# EAGLE design BMS-Shield rev2 (EAGLE 8.1.0)
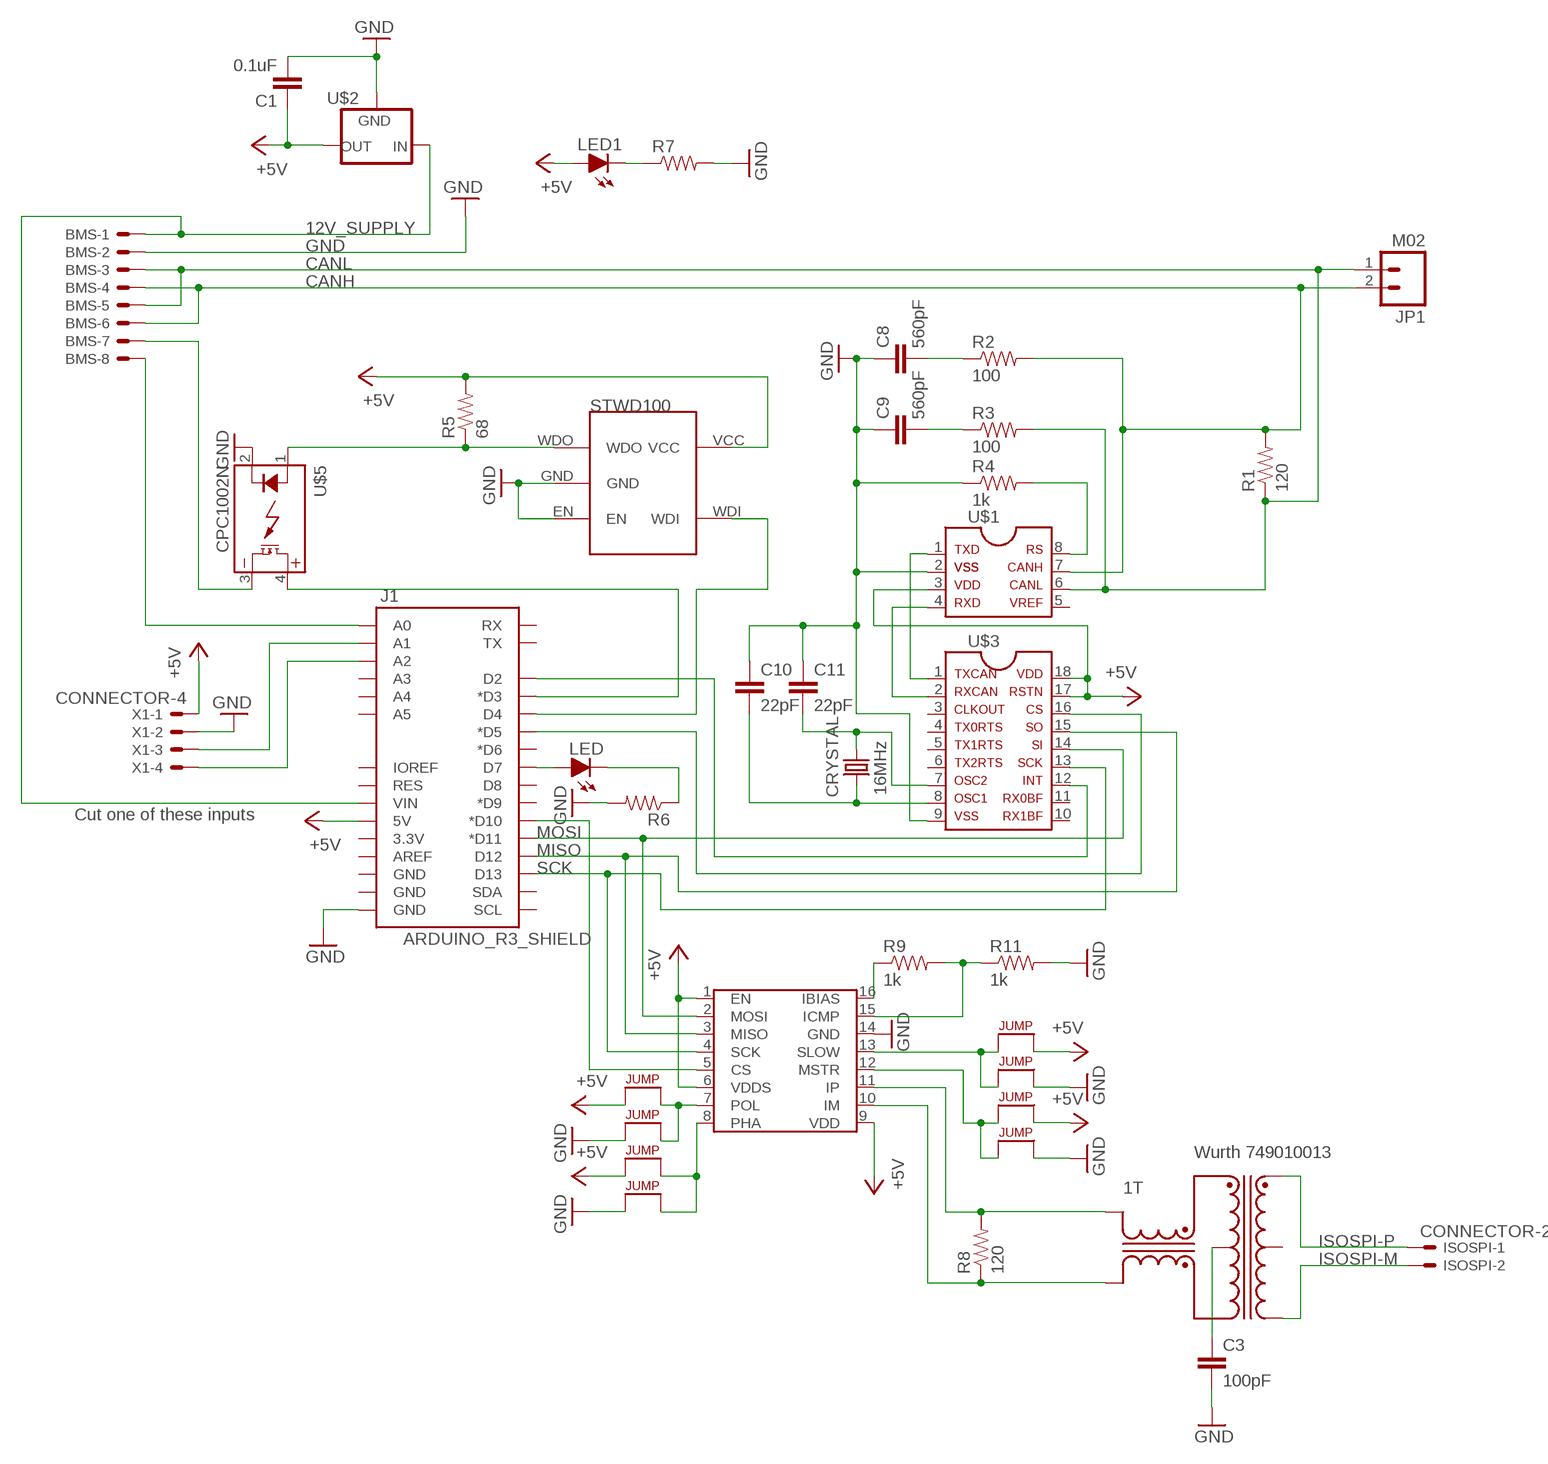
[diagram p0: schematic, sheet 1]

## Parts
1  TRANSFORMER_749010013  [749010013]
BMS  MINIFIT_5566-8  [MINIFIT_5566-8]
C1  0.1uF  CAP0805  [0805]
C3  100pF  CAP0805  [0805]
C8  560pF  CAP0805  [0805]
C9  560pF  CAP0805  [0805]
C10  22pF  CAP0805  [0805]
C11  22pF  CAP0805  [0805]
CRYSTAL  16MHz  CRYSTALSMD  [HC49UP]
ISOSPI  CONNECTOR-2  [MINIFIT_5566-2]
J1  ARDUINO_R3_SHIELD  [UNO_R3_SHIELD]
JP1  M02  [1X02]
LED  LED-0805  [LED-805]
LED1  LED-0805  [LED-805]
R1  120  RESISTOR0805-RES  [0805]
R2  100  RESISTOR0805-RES  [0805]
R3  100  RESISTOR0805-RES  [0805]
R4  1k  RESISTOR0805-RES  [0805]
R5  68  RESISTOR0805-RES  [0805]
R6  RESISTOR0805-RES  [0805]
R7  RESISTOR0805-RES  [0805]
R8  120  RESISTOR0805-RES  [0805]
R9  1k  RESISTOR0805-RES  [0805]
R11  1k  RESISTOR0805-RES  [0805]
U$1  MCP2551  [SOIC-08]
U$2  5VREG_LM340-NLM340MPX-5.0/NOPB  [SOT223]
U$3  MCP2515SMD  [SOIC-18W]
U$4  STWD100  [SOT23-5]
U$5  CPC1002N  [SOP04]
U$6  LTC6820  [MSOP-16]
U$7  JUMPER  [0805]
U$8  JUMPER  [0805]
U$9  JUMPER  [0805]
U$10  JUMPER  [0805]
U$11  JUMPER  [0805]
U$12  JUMPER  [0805]
U$13  JUMPER  [0805]
U$14  JUMPER  [0805]
X1  CONNECTOR-4  [MINIFIT_5566-4]

## Nets
12V_SUPPLY: BMS.1 J1.VIN U$2.1(IN)
+5V: C1.1 J1.5V LED1.A R5.2 U$1.3 U$2.3(OUT) U$3.17 U$3.18 U$4.VCC U$6.1(EN) U$6.6(VDDS) U$6.9(VDD) U$7.1 U$10.1 U$11.2 U$13.2 X1.1
CANH: BMS.4 BMS.6 JP1.2 R1.2 R2.2 U$1.7
CANL: BMS.3 BMS.5 JP1.1 R1.1 R3.2 U$1.6
CS: J1.D5(*D5) U$3.16
GND: BMS.2 C1.2 C3.2 C8.1 C9.1 C10.1 C11.1 J1.GND@0(GND) R4.1 R6.2 R7.2 R11.2 U$1.2 U$2.2(GND) U$2.4(GND) U$3.9 U$4.EN U$4.GND U$5.2(CONTROL-) U$6.14(GND) U$8.1 U$9.1 U$12.2 U$14.2 X1.2
ISOSPI-M: 1.3(T:D-) ISOSPI.2
ISOSPI-P: 1.1(T:D+) ISOSPI.1
MISO: J1.D12 U$3.15 U$6.3(MISO)
MOSI: J1.D11(*D11) U$3.14 U$6.2(MOSI)
N$1: BMS.8 J1.A0
N$5: R5.1 U$4.WDO U$5.1(CONTROL+)
N$6: J1.D4 U$4.WDI
N$7: J1.D7 LED.A
N$8: BMS.7 U$5.3(DC-)
N$9: J1.D3(*D3) U$5.4(DC+)
N$10: J1.D2 U$3.12
N$11: C10.2 CRYSTAL.2 U$3.8
N$12: U$1.1 U$3.1
N$13: U$1.4 U$3.2
N$14: C8.2 R2.1
N$15: C11.2 CRYSTAL.1 U$3.7
N$16: R4.2 U$1.8
N$17: C9.2 R3.1
N$18: LED.C R6.1
N$19: J1.A1 X1.3
N$20: J1.A2 X1.4
N$21: J1.D10(*D10) U$6.5(CS)
N$22: LED1.C R7.1
N$23: U$6.7(POL) U$7.2 U$8.2
N$24: U$6.8(PHA) U$9.2 U$10.2
N$25: R9.1 U$6.16(IBIAS)
N$26: R9.2 R11.1 U$6.15(ICMP)
N$27: U$6.13(SLOW) U$11.1 U$12.1
N$28: U$6.12(MSTR) U$13.1 U$14.1
N$29: 1.14(T:X-) R8.1 U$6.10(IM)
N$30: 1.16(T:X+) R8.2 U$6.11(IP)
N$31: 1.15(T:CX) C3.1
SCK: J1.D13 U$3.13 U$6.4(SCK)
Unconnected: 1.2(T:CD) 1.6(R:D+) 1.7(R:CD) 1.8(R:D-) 1.9(R:X-) 1.10(R:CX) 1.11(R:X+) J1.3.3V J1.A3 J1.A4 J1.A5 J1.AREF J1.D6(*D6) J1.D8 J1.D9(*D9) J1.GND@1(GND) J1.GND@2(GND) J1.IOREF J1.RES J1.RX J1.SCL J1.SDA J1.TX U$1.5 U$3.3 U$3.4 U$3.5 U$3.6 U$3.10 U$3.11

## Notes on the sheet
- Cut one of these inputs ➡️
- Wurth 749010013

## Library data of the parts
1 = HyTechDevices:TRANSFORMER_749010013: Wurth Electronics Midcom 749010013 10/100BaseTX Ethernet Transformer Datasheet <http://www.mouser.com/ds/2/445/749010013-311000.pdf> Mouser Page <http://www.mouser.com/ProductDetail/Wurth-Electronics-Midcom/749010013/?qs=40TFAHZMFvcjCZphxWYgVw%3D%3D>
BMS = HyTechDevices:MINIFIT_5566-8: Mini-Fit Junior connector 8 pole Source: http://www.molex.com; OC_FARNELL: unknown; OC_NEWARK: unknown
C1 C3 C8-C11 = HyTechDevices:CAP: Capacitor Standard 0603 ceramic capacitor, and 0.1" leaded capacitor.
CRYSTAL = SparkFun-FreqCtrl:CRYSTAL: Various standard crystals. Proven footprints.
ISOSPI = HyTechDevices:CONNECTOR-2: Mini-Fit Junior connector 2 pole Source: http://www.molex.com; OC_FARNELL: 1822072; OC_NEWARK: unknown
J1 = HyTechDevices:ARDUINO_R3_SHIELD: Shield form compatible with the Arduino Uno R3. Source: Sparkfun <https://github.com/sparkfun/SparkFun-Eagle-Libraries>
JP1 = HyTechDevices:M02: Standard 2-pin 0.1" header. NOTES ON THE VARIANTS LOCK and LOCK_LONGPADS... This footprint was designed to help hold the alignment of a through-hole component (i.e. 6-pin header) while soldering it into place. You may notice that each hole has been shifted either up or down by 0.005 of an inch from it's more standard position (which is a perfectly straight line). This slight alteration caused the pins (the squares in the middle) to touch the edges of the holes. Because they are alternating, it causes a "brace" to hold the component in place. 0.005 has proven to be the perfect amount of "off-center" position when using our standard breakaway headers. Although looks a little odd when you look at the bare footprint, once you have a header in there, the alteration is very hard to notice. Also,if you push a header all the way into place, it is covered up entirely on the bottom side. This idea of altering the position of holes to aid alignment will be further integrated into the Sparkfun Library for other footprints. It can help hold any component with 3 or more connection pins. Note: The Sparkfun version includes many other packages including surface mount that may be of future interest. Source: Sparkfun <https://github.com/sparkfun/SparkFun-Eagle-Libraries>
LED LED1 = HyTechDevices:LED: Light Emitting Diode (LED) Source: Dangerous Prototypes Eagle Library <https://github.com/DangerousPrototypes/Eagle_Part_Library>
R1-R9 R11 = HyTechDevices:RESISTOR: Resistor Basic schematic elements and footprints for 0603, 1206, and PTH resistors.
U$1 = HyTechDevices:MCP2551: MCP2551 High-Speed CAN Transceiver Product Webpage <https://www.microchip.com/wwwproducts/en/MCP2551> Datasheet <http://ww1.microchip.com/downloads/en/DeviceDoc/21667f.pdf> This device is outdated It is replaced by MCP2561. Comparison Page <https://www.microchip.com/wwwproducts/ProductCompare/MCP2551/MCP2561> Product Webpage <https://www.microchip.com/wwwproducts/en/MCP2561> Datasheet <http://ww1.microchip.com/downloads/en/DeviceDoc/20005167C.pdf>
U$2 = HyTechDevices:5VREG_LM340-N: Voltage Regulator 5v linear voltage regulator Datasheet <http://www.mouser.com/ProductDetail/Texas-Instruments/LM340MPX-50-NOPB/?qs=X1J7HmVL2ZGZwtTFRQ9ItA%3D%3D> MAX current out: 1.5A MAX voltage in: 35V
U$3 = HyTechDevices:MCP2515: MCP2515 CAN Controller with SPI Interface Datasheet <http://ww1.microchip.com/downloads/en/DeviceDoc/21801G.pdf>
U$4 = HyTechDevices:STWD100: STWD100 Watchdog timer
U$5 = HyTechDevices:CPC1002N: IXYS Solid State Relay .7A
U$6 = HyTechDevices:LTC6820
U$7-U$14 = HyTechDevices:JUMPER: Jumper for changing operation of a device
X1 = HyTechDevices:CONNECTOR-4: Mini-Fit Junior connector 4 pole Source: http://www.molex.com; OC_FARNELL: unknown; OC_NEWARK: unknown

## Board
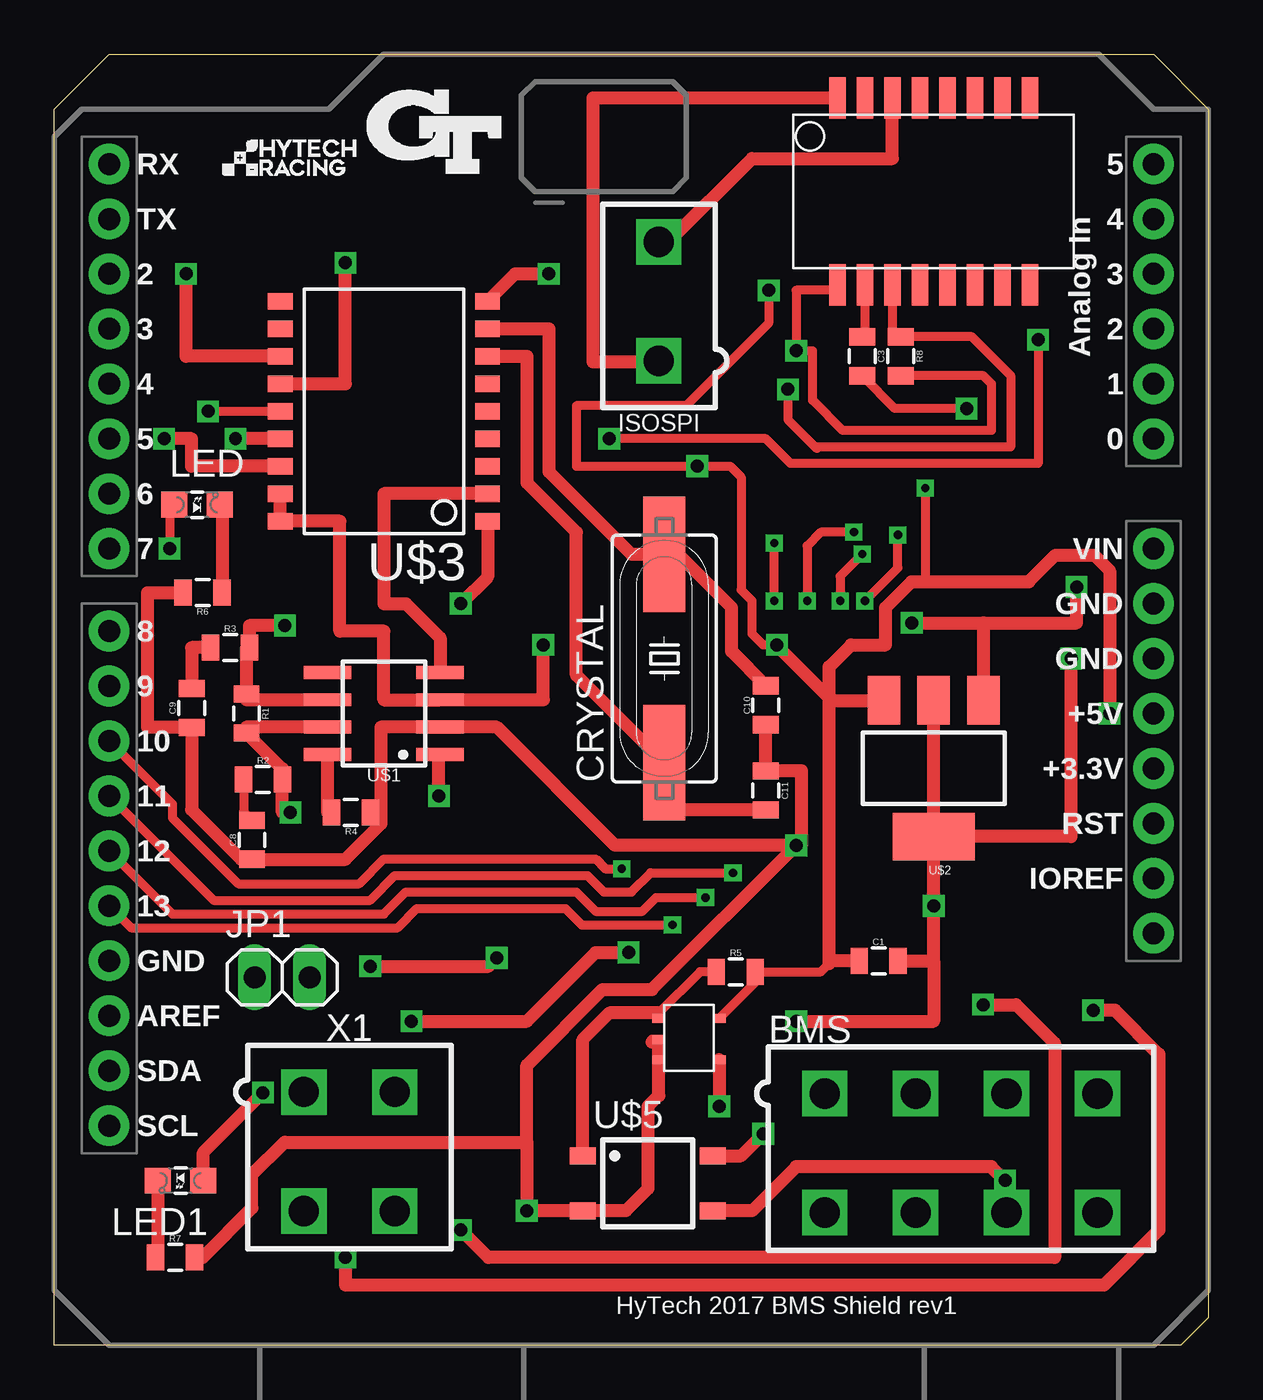
[diagram p1: board, top side]
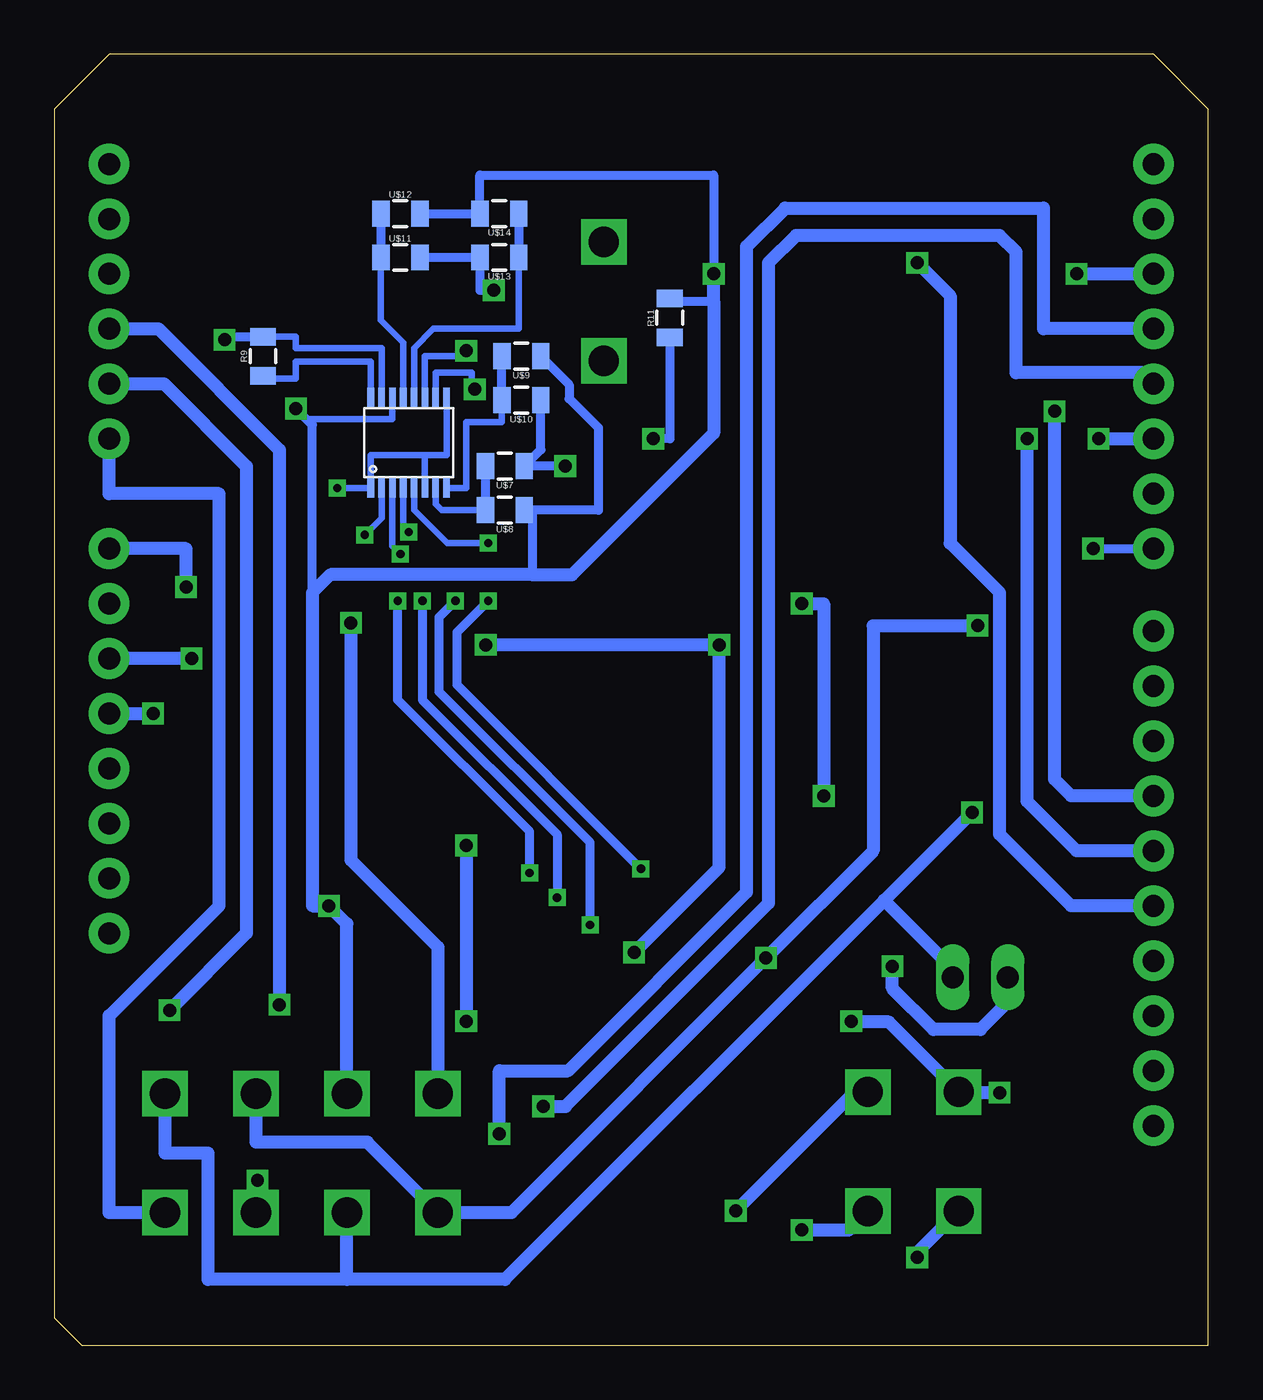
[diagram p2: board, bottom side, seen from below]

Size 53.34 x 59.69 mm. Coordinates in mm from the lower left corner, seen from the top.
Outline: 0,0 0,57.15 2.54,59.69 50.8,59.69 53.34,57.15 53.34,1.27 52.07,0 0,0
Copper layers (1*16): Top 0.035mm / dielectric 1.5mm / Bottom 0.035mm
Design rules "default *": minimum track width 10mil, minimum drill 24mil, track to track 6mil, track to pad 6mil, pad to pad 6mil, via to via 6mil, smd to smd 6mil, copper to edge 40mil, drill to drill 8mil, minimum pad ring 10mil, minimum via ring 8mil, stop-mask expansion 4mil, vias tented up to drill 0mil, thermal gap 10mil

### Footprints (pad centres in the part's own frame; a part is rotated, then mirrored left to right if it is on the bottom)
749010013 = smd 1.905 x 0.762: 1 4.318,4.445; 2 4.318,3.175; 3 4.318,1.905; 4 4.318,0.635; 5 4.318,-0.635; 6 4.318,-1.905; 7 4.318,-3.175; 8 4.318,-4.445; 9 -4.318,-4.445; 10 -4.318,-3.175; 11 -4.318,-1.905; 12 -4.318,-0.635; 13 -4.318,0.635; 14 -4.318,1.905; 15 -4.318,3.175; 16 -4.318,4.445
MINIFIT_5566-8 = drill 1.4 square: 1 6.3,-2.75; 2 2.1,-2.75; 3 -2.1,-2.75; 4 -6.3,-2.75; 5 6.3,2.75; 6 2.1,2.75; 7 -2.1,2.75; 8 -6.3,2.75
0805 = smd 0.8 x 1.2: 1 -0.9,0; 2 0.9,0
HC49UP = smd 5.334 x 1.93: 1 -4.826,0; 2 4.826,0
MINIFIT_5566-2 = drill 1.4 square: 1 0,-2.75; 2 0,2.75
UNO_R3_SHIELD = drill 1.016 pad 1.88: 3.3V 50.8,26.67; 5V 50.8,29.21; A0 50.8,41.91; A1 50.8,44.45; A2 50.8,46.99; A3 50.8,49.53; A4 50.8,52.07; A5 50.8,54.61; AREF 2.54,15.24; D2 2.54,49.53; D3 2.54,46.99; D4 2.54,44.45; D5 2.54,41.91; D6 2.54,39.37; D7 2.54,36.83; D8 2.54,33.02; D9 2.54,30.48; D10 2.54,27.94; D11 2.54,25.4; D12 2.54,22.86; D13 2.54,20.32; GND@0 50.8,31.75; GND@1 50.8,34.29; GND@2 2.54,17.78; IOREF 50.8,21.59; NC 50.8,19.05; RES 50.8,24.13; RX 2.54,54.61; SCL 2.54,10.16; SDA 2.54,12.7; TX 2.54,52.07; VIN 50.8,36.83
1X02 = drill 1.016 long: 1 -1.27,0; 2 1.27,0
LED-805 = smd 1.2 x 1.2: A 0,-1.05; C 0,1.05
SOIC-08 = smd 0.6 x 2.2: 1 -1.905,-2.6; 2 -0.635,-2.6; 3 0.635,-2.6; 4 1.905,-2.6; 5 1.905,2.6; 6 0.635,2.6; 7 -0.635,2.6; 8 -1.905,2.6
SOT223 = smd 1.5 x 2.235: 1 -2.3,-3.15; 2 0,-3.15; 3 2.3,-3.15 | smd 3.8 x 2.2: 4 0,3.15
SOIC-18W = smd 0.762 x 1.143: 1 -5.08,-4.788; 2 -3.81,-4.788; 3 -2.54,-4.788; 4 -1.27,-4.788; 5 0,-4.788; 6 1.27,-4.788; 7 2.54,-4.788; 8 3.81,-4.788; 9 5.08,-4.788; 10 5.08,4.788; 11 3.81,4.788; 12 2.54,4.788; 13 1.27,4.788; 14 0,4.788; 15 -1.27,4.788; 16 -2.54,4.788; 17 -3.81,4.788; 18 -5.08,4.788
SOT23-5 = smd 0.61 x 0.406: EN -2.794,0; GND -2.794,0.94; VCC 0,1.905; WDI 0,0; WDO -2.794,1.905
SOP04 = smd 0.8 x 1.2: 1 -1.27,-3; 2 1.27,-3; 3 1.27,3; 4 -1.27,3
MSOP-16 = smd 0.305 x 0.889: 1 -0.1,-0.5; 2 0.4,-0.5; 3 0.9,-0.5; 4 1.4,-0.5; 5 1.9,-0.5; 6 2.4,-0.5; 7 2.9,-0.5; 8 3.4,-0.5; 9 3.4,3.7; 10 2.9,3.7; 11 2.4,3.7; 12 1.9,3.7; 13 1.4,3.7; 14 0.9,3.7; 15 0.4,3.7; 16 -0.1,3.7
MINIFIT_5566-4 = drill 1.4 square: 1 2.1,-2.75; 2 -2.1,-2.75; 3 2.1,2.75; 4 -2.1,2.75

### Placement (x,y rotation side)
1  40.64,53.34 90 top
BMS  41.91,8.89 180 top
C1  38.1,17.78 0 top
C3  37.34,45.72 270 top
C8  9.14,23.37 90 top
C9  6.35,29.46 90 top
C10  32.89,29.59 90 top
C11  32.89,25.65 270 top
CRYSTAL  28.19,31.75 90 top
ISOSPI  27.94,48.26 0 top
J1  0,0 0 top
JP1  10.54,17.02 0 top
LED  6.6,38.86 270 top
LED1  5.84,7.62 90 top
R1  8.89,29.21 270 top
R2  9.65,26.16 0 top
R3  8.13,32.26 0 top
R4  13.72,24.64 180 top
R5  31.5,17.27 0 top
R6  6.86,34.8 180 top
R7  5.59,4.06 0 top
R8  39.12,45.72 270 top
R9  43.69,45.72 90 bottom
R11  24.89,47.5 90 bottom
U$1  15.24,29.21 90 top
U$2  40.64,26.67 180 top
U$3  15.24,43.18 90 top
U$4  30.73,13.21 0 top
U$5  27.43,7.49 270 top
U$6  38.61,40.13 0 bottom
U$7  32.51,40.64 180 bottom
U$8  32.51,38.61 180 bottom
U$9  31.75,45.72 180 bottom
U$10  31.75,43.69 180 bottom
U$11  37.34,50.29 0 bottom
U$12  37.34,52.32 0 bottom
U$13  32.77,50.29 180 bottom
U$14  32.77,52.32 180 bottom
X1  13.64,8.97 180 top

### Tracks (layer width: path | path; a pad name or v marks a point on that pad's centre or on a via)
12V_SUPPLY  (via drill 0.6)
  Top 0.61: v39.62,33.4 42.94,33.4 | 42.94,33.4 U$2.1 | 42.94,33.4 47.24,33.4 v47.24,35.05
  Bottom 0.61: v47.24,35.05 47.24,36.83 J1.VIN | BMS.1 35.61,18.41 39.62,22.43 v39.62,33.4
+5V  (via drill 0.38, 0.6)
  Top 0.406: U$2.3 38.47,29.82 | v33.02,48.77 33.02,47.24 29.21,43.43 24.13,43.43 24.13,40.64 v29.72,40.64 31.24,40.64 31.75,40.13 31.75,34.92 32.26,34.42 32.26,32.89 32.77,32.38 v33.4,32.38 | v40.26,39.62 40.26,35.31 | U$4.VCC 32.4,16.77 R5.2 35.43,17.27 35.81,17.65
  Top 0.61: 35.81,29.82 35.94,29.82 | 35.94,29.82 U$2.3 | 35.81,29.82 35.81,17.65 35.94,17.78 C1.1 | U$3.17 U$3.18 13.21,38.1 13.21,33.02 15.24,33.02 15.24,29.84 U$1.3 22.61,29.84 v22.61,32.38 | 35.81,29.82 35.81,31.37 36.83,32.38 38.42,32.38 38.42,34.1 39.62,35.31 40.26,35.31 45.04,35.31 46.27,36.53 48.05,36.53 48.77,35.81 v48.77,29.21 | LED1.A 6.89,8.92 v9.65,11.68 | v16.51,14.99 21.84,14.99 25.02,18.16 v26.54,18.16 | 35.94,29.82 33.4,32.36 v33.4,32.38
  Bottom 0.305: U$6.6 36.21,41.15 | 36.21,41.15 38.71,41.15 U$6.1 v40.26,39.62 | 36.21,41.15 35.21,41.15 U$6.9
  Bottom 0.406: v29.72,40.64 U$7.1 30.85,41.4 U$10.1 | U$11.2 U$13.2 33.67,48.77 v33.02,48.77
  Bottom 0.61: v33.4,32.38 v22.61,32.38 22.61,22.1 v26.54,18.16 | J1.5V v48.77,29.21 | v9.65,11.68 11.51,11.68 X1.1 14.77,14.95 16.47,14.95 v16.51,14.99
CANH  (via drill 0.6)
  Top 0.406: 8.89,28.57 R1.2 9.03,28.31 | v10.92,24.64 10.55,24.64
  Top 0.61: U$1.7 8.89,28.57 | 10.55,24.64 R2.2 10.55,26.65 R1.2
  Bottom 0.61: 39.81,3.05 BMS.6 | BMS.4 48.21,8.89 46.23,8.89 46.23,3.05 39.81,3.05 | 14.99,20.57 v10.92,24.64 | 14.99,20.57 32.51,3.05 39.81,3.05 | JP1.2 11.81,17.4 14.99,20.57
CANL  (via drill 0.6)
  Top 0.406: R1.1 8.89,29.84 | R3.2 8.89,32.26
  Top 0.61: U$1.6 8.89,29.84 | 8.89,32.26 R1.1 | v10.67,33.27 9.03,33.27 R3.2 | v14.61,17.53 20.07,17.53 v20.45,17.91
  Bottom 0.61: BMS.3 44.01,9.4 38.87,9.4 BMS.5 32.21,6.14 v20.45,17.91 15.49,22.86 15.49,33.27 v10.67,33.27 | JP1.1 9.27,15.88 10.54,14.61 12.7,14.61 14.61,16.51 v14.61,17.53
CS  (via drill 0.6)
  Top 0.61: U$3.16 6.35,40.64 6.35,41.91 v5.08,41.91
  Bottom 0.61: v5.08,41.91 J1.D5
GND  (via drill 0.6)
  Top 0.406: U$2.2 40.27,29.82 | 15.11,24.64 R4.1 | U$4.GND 27.64,14.15 27.64,14.02 | v42.16,43.31 38.85,43.31 C3.2
  Top 0.61: U$2.4 46.99,23.52 v46.99,31.75 | U$2.4 v40.64,20.32 40.64,17.78 | U$2.4 U$2.2 | C10.1 C11.1 34.54,26.55 34.54,23.11 v34.29,23.11 | v34.29,23.11 25.91,23.11 20.45,28.57 U$1.2 15.11,28.57 15.11,24.64 15.11,24.12 13.46,22.47 C8.1 8.64,22.47 6.35,24.75 C9.1 4.32,28.56 4.32,34.8 R6.2 | 21.84,9.4 v21.84,6.22 U$5.2 26.42,6.22 27.43,7.24 27.43,11.05 27.94,11.56 U$4.EN 27.94,14.02 27.64,14.02 | 21.84,9.4 21.84,12.95 25.34,16.45 27.62,16.45 v34.29,23.11 | U$3.9 21.3,49.53 v22.86,49.53 | v34.29,14.99 40.64,14.99 40.64,17.78 | R7.2 6.86,4.06 9.14,6.35 9.14,7.87 10.67,9.4 21.84,9.4 | C1.2 40.64,17.78
  Bottom 0.305: U$6.14 37.71,42.81 41.67,42.81 v42.16,43.31
  Bottom 0.406: 31.24,35.62 31.24,38.61 U$8.1 28.19,38.61 28.19,42.42 29.54,43.76 29.54,44.41 U$9.1 | U$12.2 U$14.2 33.67,54.1 22.86,54.1 v22.86,49.53 | R11.2 24.89,48.26 22.86,48.26 | 41.4,34.8 41.4,42.55 v42.16,43.31
  Bottom 0.61: v46.99,31.75 J1.GND@0 | BMS.2 39.81,19.49 v40.64,20.32 41.4,20.32 41.4,34.8 40.58,35.62 31.24,35.62 29.4,35.62 22.86,42.16 22.86,48.26 v22.86,49.53 | v34.29,23.11 v34.29,14.99 | v21.84,6.22 16.35,11.72 X1.2
ISOSPI-M
  Top 0.61: ISOSPI.2 28.4,51.01 32.26,54.86 38.73,54.86 1.3
ISOSPI-P
  Top 0.61: 1.1 24.89,57.66 24.89,45.47 27.94,45.47 ISOSPI.1
MISO  (via drill 0.38, 0.6)
  Top 0.406: J1.D12 5.46,19.94 15.24,19.94 16.26,20.95 24.13,20.95 25.02,20.07 27.18,20.07 27.81,20.7 v30.1,20.7 | v37.34,36.58 36.32,35.56 v36.32,34.42
  Top 0.61: U$3.15 v8.38,41.91
  Bottom 0.305: v37.34,36.58 37.71,36.95 U$6.3
  Bottom 0.406: v30.1,20.7 30.1,23.62 36.32,29.84 v36.32,34.42
  Bottom 0.61: v8.38,41.91 8.38,25.15 6.1,22.86 J1.D12
MOSI  (via drill 0.38, 0.6)
  Top 0.406: v7.11,43.18 U$3.14 | J1.D11 7.37,20.57 14.61,20.57 15.75,21.72 24.64,21.72 25.4,20.95 26.67,20.95 27.56,21.84 v31.37,21.84 | v37.47,34.42 38.99,35.94 v38.99,37.47
  Bottom 0.305: v38.99,37.47 38.21,38.25 U$6.2
  Bottom 0.406: v31.37,21.84 31.37,23.75 37.47,29.84 v37.47,34.42
  Bottom 0.61: v7.11,43.18 7.11,26.16 6.35,25.4 J1.D11
N$1
  Bottom 0.61: BMS.8 50.8,6.14 50.8,15.24 45.72,20.32 45.72,39.37 50.8,39.37 J1.A0
N$5
  Top 0.406: U$4.WDO 27.94,15.37 29.84,17.27 R5.1
  Top 0.61: U$5.1 24.43,14.14 25.65,15.37 27.94,15.37
N$6  (via drill 0.6)
  Top 0.61: U$4.WDI v30.73,11.05
  Bottom 0.61: J1.D4 3.05,44.96 8.89,44.96 8.89,50.55 9.65,51.31 19.05,51.31 20.32,50.04 20.32,20.45 29.72,11.05 v30.73,11.05
N$7  (via drill 0.6)
  Top 0.406: LED.A 5.33,38.86 v5.33,36.83
  Bottom 0.406: v5.33,36.83 J1.D7
N$8  (via drill 0.6)
  Top 0.61: v43.94,7.62 43.31,8.26 34.29,8.26 32.26,6.22 U$5.3
  Bottom 0.61: v43.94,7.62 44.01,7.55 BMS.7
N$9  (via drill 0.6)
  Top 0.61: U$5.4 31.75,8.76 v32.77,9.78
  Bottom 0.61: J1.D3 7.62,46.99 7.62,52.58 19.56,52.58 21.34,50.8 21.34,20.95 29.59,12.7 32.77,12.7 v32.77,9.78
N$10  (via drill 0.6)
  Top 0.61: U$3.12 6.1,45.72 v6.1,49.53
  Bottom 0.61: v6.1,49.53 J1.D2
N$11
  Top 0.61: U$3.8 22.86,46.99 22.86,40.39 26.67,36.58 CRYSTAL.2 28.83,36.58 31.3,34.1 31.3,32.08 C10.2
N$12  (via drill 0.6)
  Top 0.406: 20.07,38.1 U$3.1
  Top 0.61: v17.78,25.4 17.78,27.3 U$1.1 | U$3.1 20.03,35.52 v18.8,34.29
  Bottom 0.61: v18.8,34.29 17.78,34.29 v17.78,25.4
N$13
  Top 0.61: U$3.2 15.24,39.37 15.24,34.29 16.26,34.29 17.84,32.71 U$1.4
N$14
  Top 0.406: C8.2 8.75,24.66 R2.1
N$15
  Top 0.61: U$3.7 21.84,45.72 21.84,39.88 24.13,37.59 24.13,30.99 CRYSTAL.1 28.19,24.75 C11.2
N$16
  Top 0.406: R4.2 12.64,24.64
  Top 0.61: 12.64,24.64 U$1.8
N$17
  Top 0.406: 7.23,32.4 R3.1
  Top 0.61: R3.1 6.35,32.26 C9.2
N$18
  Top 0.406: LED.C 7.76,38.86
  Top 0.61: 7.76,38.86 R6.1
N$19  (via drill 0.6)
  Top 0.61: v13.46,4.06 13.46,2.79 48.51,2.79 51.05,5.33 51.05,13.46 49.02,15.49 v48.01,15.49
  Bottom 0.61: J1.A1 48.26,44.45 44.45,40.64 44.45,19.05 v48.01,15.49 | v13.46,4.06 13.46,4.29 X1.3
N$20  (via drill 0.6)
  Top 0.61: v42.93,15.75 44.45,15.75 46.23,13.97 46.23,4.06 20.07,4.06 v18.8,5.33
  Bottom 0.61: J1.A2 48.51,46.99 42.93,41.4 v42.93,15.75 | v18.8,5.33 16.62,5.33 X1.4
N$21  (via drill 0.38)
  Top 0.406: v33.27,34.42 v33.27,37.08 | J1.D10 5.46,25.02 5.46,24.38 8.51,21.34 14.1,21.34 15.24,22.48 25.02,22.48 25.46,22.04 v26.23,22.04
  Bottom 0.305: v33.27,37.08 35.18,37.08 36.71,38.61 U$6.5
  Bottom 0.406: v26.23,22.04 34.73,30.54 34.73,32.96 v33.27,34.42
N$22
  Top 0.61: LED1.C 4.79,4.17 R7.1
N$23
  Bottom 0.305: U$8.2 35.43,38.61 35.71,38.88 U$6.7
  Bottom 0.406: U$7.2 U$8.2
N$24
  Bottom 0.305: U$6.8 34.29,39.63 34.29,42.67 32.65,42.67 U$10.2
  Bottom 0.406: U$10.2 U$9.2
N$25
  Bottom 0.305: R9.1 43.57,44.7 42.16,44.7 42.16,45.47 38.71,45.47 U$6.16
N$26  (via drill 0.6)
  Top 0.406: v25.65,41.91 32.89,41.91 34.04,40.77 45.47,40.77 v45.47,46.48
  Bottom 0.305: U$6.15 38.21,46.1 42.16,46.1 42.16,46.62 R9.2
  Bottom 0.406: R11.1 24.89,41.91 v25.65,41.91 | v45.47,46.48 45.47,46.62 R9.2
N$27
  Bottom 0.305: U$11.1 38.24,47.38 37.21,46.35 U$6.13
  Bottom 0.406: U$12.1 U$11.1
N$28
  Bottom 0.305: U$13.1 31.87,46.99 35.81,46.99 36.71,46.1 U$6.12
  Bottom 0.406: U$14.1 U$13.1
N$29  (via drill 0.6)
  Top 0.406: 1.14 38.73,46.62 R8.1 42.41,46.62 44.2,44.83 44.2,41.53 35.31,41.53 35.24,41.47 33.91,42.8 v33.91,44.2
  Bottom 0.305: U$6.10 35.71,44.96 34.04,44.96 34.04,44.2 v33.91,44.2
N$30  (via drill 0.6)
  Top 0.406: 36.2,48.77 34.29,48.77 v34.29,45.97 35.05,45.97 35.05,43.69 36.45,42.29 43.31,42.29 43.31,44.45 42.94,44.82 R8.2
  Top 0.61: 1.16 36.2,48.77
  Bottom 0.305: U$6.11 36.21,45.72 34.29,45.72 v34.29,45.97
N$31
  Top 0.406: 1.15 37.47,46.62
  Top 0.61: 37.47,46.62 C3.1
SCK  (via drill 0.38, 0.6)
  Top 0.406: J1.D13 3.56,19.3 15.88,19.3 16.76,20.19 23.62,20.19 24.38,19.43 v28.57,19.43 | v36.96,37.59 35.43,37.59 34.8,36.96 v34.8,34.42
  Top 0.61: U$3.13 13.46,44.45 v13.46,50.04
  Bottom 0.305: U$6.4 37.21,37.85 v36.96,37.59
  Bottom 0.406: v28.57,19.43 28.57,23.24 35.56,30.23 35.56,33.66 v34.8,34.42
  Bottom 0.61: v13.46,50.04 11.94,48.51 11.94,37.08 9.65,34.8 9.65,23.62 6.35,20.32 J1.D13

### Text on the board
tPlace: HyTech 2017 BMS Shield rev1